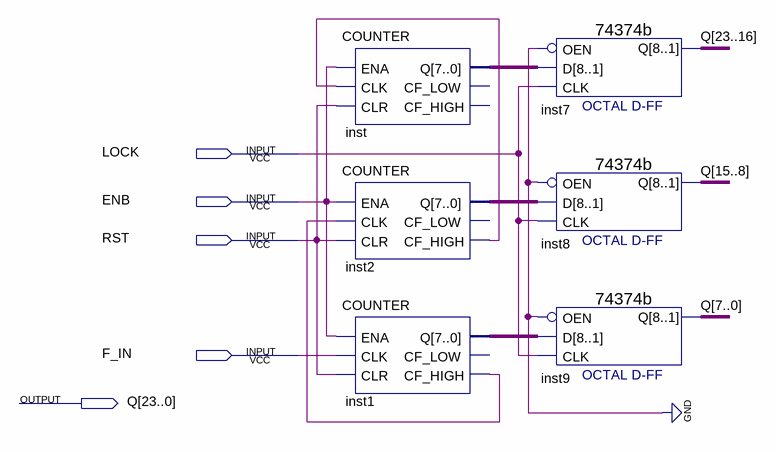
[diagram p0: schematic sheet]
// Quartus schematic CNT10.bdf as structural Verilog: 6 symbols, 5 pins
module CNT10 (
  input  LOCK,
  input  ENB,
  input  RST,
  input  F_IN,
  output [23:0] Q
);

  wire inst1_cf_high, inst2_cf_high;
  wire [7:0] inst1_q, inst2_q, inst_q;

  COUNTER inst (.ENA(ENB), .CLK(inst2_cf_high), .CLR(RST), .Q(inst_q));  // open: CF_LOW, CF_HIGH
  COUNTER inst2 (.ENA(ENB), .CLK(inst1_cf_high), .CLR(RST), .Q(inst2_q), .CF_HIGH(inst2_cf_high));  // open: CF_LOW
  COUNTER inst1 (.ENA(ENB), .CLK(F_IN), .CLR(RST), .Q(inst1_q), .CF_HIGH(inst1_cf_high));  // open: CF_LOW
  \74374b  inst7 (.D(inst_q), .OEN(1'b0), .CLK(LOCK), .Q(Q[23:16]));
  \74374b  inst8 (.D(inst2_q), .OEN(1'b0), .CLK(LOCK), .Q(Q[15:8]));
  \74374b  inst9 (.D(inst1_q), .OEN(1'b0), .CLK(LOCK), .Q(Q[7:0]));
endmodule
